# Altium schematic sheet [19]-CAMERA_PWR_CONNECTORS.SchDoc
size A4
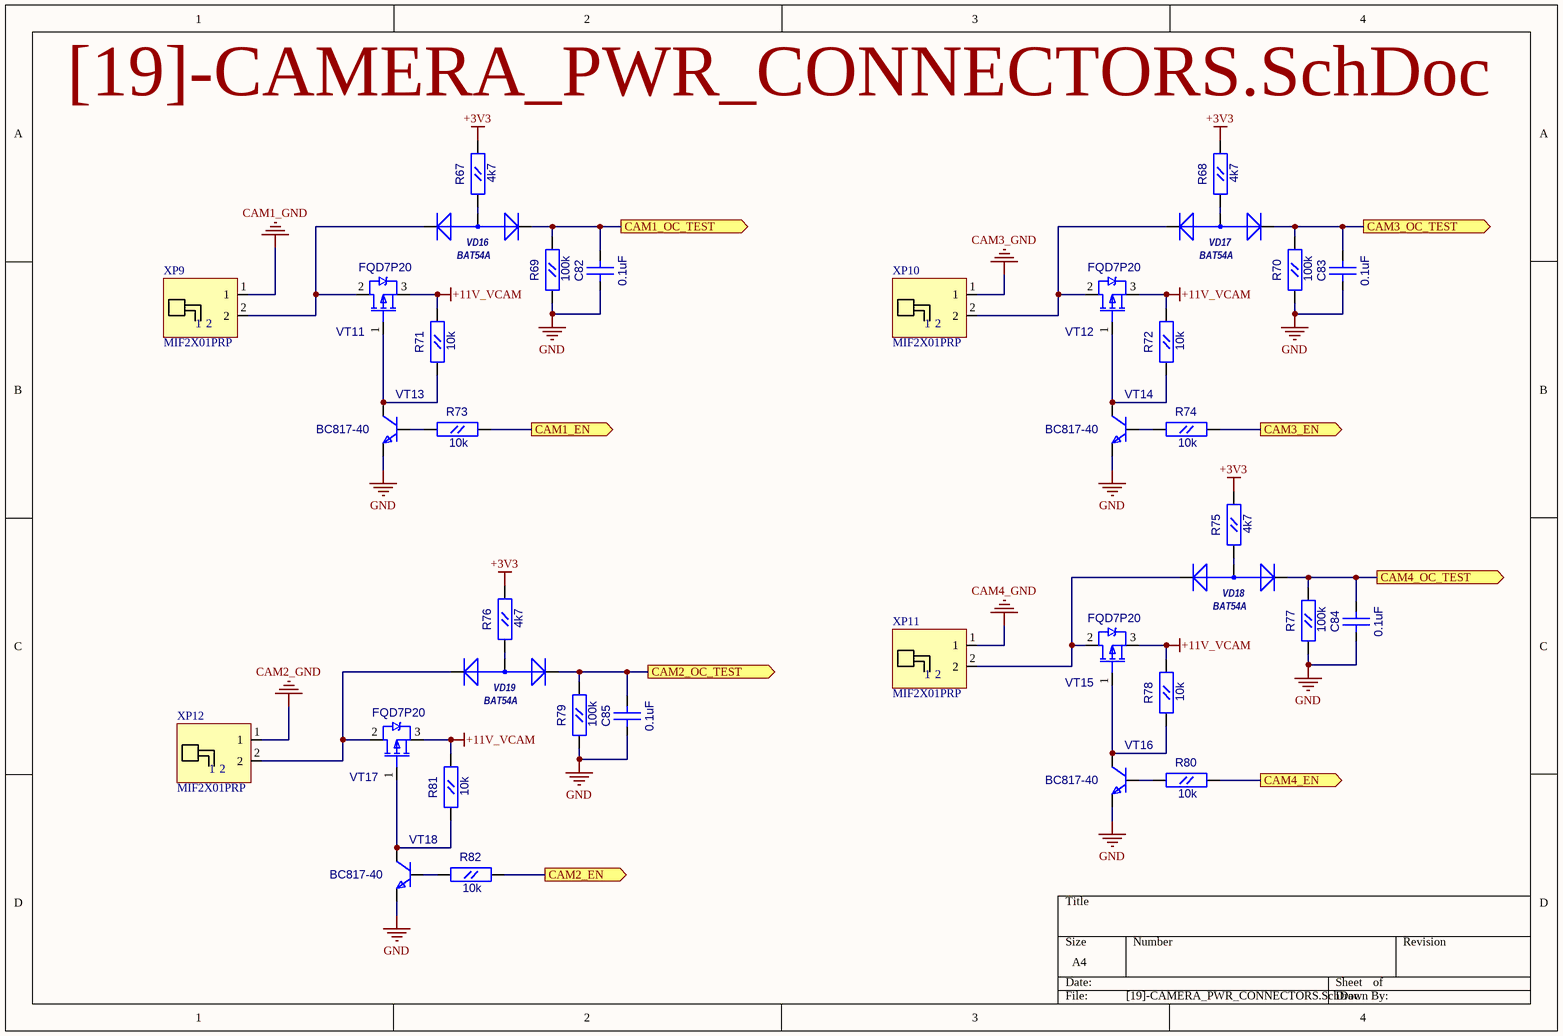
[diagram p0: [19]-CAMERA_PWR_CONNECTORS.SchDoc]

## Parts
C82  0.1uF  [CC0603]
C83  0.1uF  [CC0603]
C84  0.1uF  [CC0603]
C85  0.1uF  [CC0603]
R67  4k7  [RC0603]
R68  4k7  [RC0603]
R69  100k  [RC0603]
R70  100k  [RC0603]
R71  10k  [RC0603]
R72  10k  [RC0603]
R73  10k  [RC0603]
R74  10k  [RC0603]
R75  4k7  [RC0603]
R76  4k7  [RC0603]
R77  100k  [RC0603]
R78  10k  [RC0603]
R79  100k  [RC0603]
R80  10k  [RC0603]
R81  10k  [RC0603]
R82  10k  [RC0603]
VD16  BAT54A  [SOT-23(123)]
VD17  BAT54A  [SOT-23(123)]
VD18  BAT54A  [SOT-23(123)]
VD19  BAT54A  [SOT-23(123)]
VT11  FQD7P20  [D-PAK(TO-252AA)]
VT12  FQD7P20  [D-PAK(TO-252AA)]
VT13  BC817-40  [SOT-23(123)]
VT14  BC817-40  [SOT-23(123)]
VT15  FQD7P20  [D-PAK(TO-252AA)]
VT16  BC817-40  [SOT-23(123)]
VT17  FQD7P20  [D-PAK(TO-252AA)]
VT18  BC817-40  [SOT-23(123)]
XP9  MIF2X01PRP  [MIF2x01PRP]
XP10  MIF2X01PRP  [MIF2x01PRP]
XP11  MIF2X01PRP  [MIF2x01PRP]
XP12  MIF2X01PRP  [MIF2x01PRP]

## Ports
CAM1_EN (out), CAM1_OC_TEST (out), CAM2_EN (out), CAM2_OC_TEST (out), CAM3_EN (out), CAM3_OC_TEST (out), CAM4_EN (out), CAM4_OC_TEST (out)

## Nets
+3V3: R67.2(B) R68.2(B) R75.2(B) R76.2(B)
+11V_VCAM: R71.2(B) R72.2(B) R78.2(B) R81.2(B) VT11.3(S) VT12.3(S) VT15.3(S) VT17.3(S)
CAM1_GND: XP9.1
CAM2_GND: XP12.1
CAM3_GND: XP10.1
CAM4_GND: XP11.1
GND: C82.1(A) C83.1(A) C84.1(A) C85.1(A) R69.1(A) R70.1(A) R77.1(A) R79.1(A) VT13.2(E) VT14.2(E) VT16.2(E) VT18.2(E)
CAM1_EN: R73.2(B) ; port CAM1_EN
CAM1_OC_TEST: C82.2(B) R69.2(B) VD16.2(K) ; port CAM1_OC_TEST
CAM2_EN: R82.2(B) ; port CAM2_EN
CAM2_OC_TEST: C85.2(B) R79.2(B) VD19.2(K) ; port CAM2_OC_TEST
CAM3_EN: R74.2(B) ; port CAM3_EN
CAM3_OC_TEST: C83.2(B) R70.2(B) VD17.2(K) ; port CAM3_OC_TEST
CAM4_EN: R80.2(B) ; port CAM4_EN
CAM4_OC_TEST: C84.2(B) R77.2(B) VD18.2(K) ; port CAM4_OC_TEST
NetR67_1: R67.1(A) VD16.3(A)
NetR68_1: R68.1(A) VD17.3(A)
NetR71_1: R71.1(A) VT11.1(G) VT13.3(C)
NetR72_1: R72.1(A) VT12.1(G) VT14.3(C)
NetR73_1: R73.1(A) VT13.1(B)
NetR74_1: R74.1(A) VT14.1(B)
NetR75_1: R75.1(A) VD18.3(A)
NetR76_1: R76.1(A) VD19.3(A)
NetR78_1: R78.1(A) VT15.1(G) VT16.3(C)
NetR80_1: R80.1(A) VT16.1(B)
NetR81_1: R81.1(A) VT17.1(G) VT18.3(C)
NetR82_1: R82.1(A) VT18.1(B)
NetVD16_1: VD16.1(K) VT11.2(D) XP9.2
NetVD17_1: VD17.1(K) VT12.2(D) XP10.2
NetVD18_1: VD18.1(K) VT15.2(D) XP11.2
NetVD19_1: VD19.1(K) VT17.2(D) XP12.2

## Library data of the parts
C82-C85 = CC0603: Value: 0.1uF
R67-R82 = RC0603
  R67 R68 R75 R76: Value: 4k7
  R69 R70 R77 R79: Value: 100k
  R71-R74 R78 R80-R82: Value: 10k
VD16-VD19 = BAT54A: 1.0 Ampere General Purpose Rectifier; ComponentField6: Published 8-Jun-2000, Modified 11-July-2000: SIM Model Added.; Value: *
VT11 VT12 VT15 VT17 = IRFR9220: HEXFET Power MOSFET; OriginalName: IRLML5103; ComponentField7: Published 8-Jun-2000; Value: FQD7P20
VT13 VT14 VT16 VT18 = BC846BLT1: NPN 500ma transistor; ComponentField7: Published 29-Sep-2000; OriginalName: BC846BLT1; Value: BC817-40
XP9-XP12 = MIF2X01PRP: Molex connector 3.0mm pitch; Value: MIF2X01PRP